# EAGLE schematic v1 (EAGLE 7.3.0)
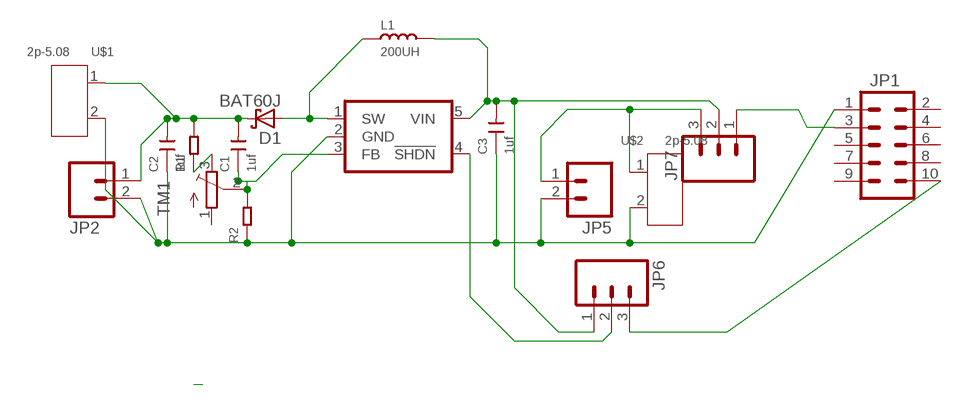
[diagram p0: schematic, sheet 1]

## Parts
C1  1uf  CERAMIC-1UF-25V-10%-X7R(0805)  [C0805]
C2  1uf  CERAMIC-1UF-25V-10%-X7R(0805)  [C0805]
C3  1uf  CERAMIC-1UF-25V-10%-X7R(0805)  [C0805]
D1  BAT60J  [SOD323_ST]
IC1  IC_FAN5331-SOT-23-5  [SOT-23-5]
JP1  M05X2PTH  [AVR_ICSP]
JP2  M02PTH  [1X02]
JP5  M02PTH  [1X02]
JP6  M03PTH  [1X03]
JP7  M03PTH  [1X03]
L1  200UH  SMD-INDUCTOR-200UH-20%(2P-5X5MM)  [SMD-2P-5.0X5.0X2.0MM]
R1  RES-0805  [R0805]
R2  RES-0805  [R0805]
TM1  TRIMPOTTC33X  [TC33X]
U$1  2p-5.08  DIP-BLUE-SCREW-TERMINAL(2P-5.08)  [H2-5.0-10.5X8.0MM]
U$2  2p-5.08  DIP-BLUE-SCREW-TERMINAL(2P-5.08)  [H2-5.0-10.5X8.0MM]

## Nets
GND: C2.1 C3.1 IC1.2(GND) JP1.1 JP2.2 JP5.2 R2.1 U$1.2 U$2.2
N$2: JP1.3 JP7.1
N$3: C3.2 IC1.5(VIN) JP6.1 JP7.2 L1.2
N$4: IC1.4(!SHDN) JP6.2
N$5: JP1.10 JP6.3
N$6: D1.A IC1.1(SW) L1.1
N$8: C1.2 C2.2 D1.C JP2.1 R1.2 U$1.1
N$9: C1.1 IC1.3(FB) R2.2 TM1.2(S)
N$10: JP5.1 JP7.3 U$2.1
N$11: R1.1 TM1.3(E)
Unconnected: JP1.2 JP1.4 JP1.5 JP1.6 JP1.7 JP1.8 JP1.9 TM1.1(A)

## Library data of the parts
C1-C3 = Seeed-OPL-Capacitor:CERAMIC-1UF-25V-10%-X7R(0805): 302010179; MPN: CC0805KKX7R8BB105
D1 = diode:BAT60J: Schottky barrier diode Source: www.st.com, BAT60J.pdf
IC1 = dp_devices:IC_FAN5331
JP1 = SparkFun-Connectors:M05X2: Header 5x2 Standard 10-pin dual row 0.1" header. Commonly used with AVR-ISP. Use with Spark Fun Electronics SKU: PRT-00778
JP2 JP5 = SparkFun-Connectors:M02: Standard 2-pin 0.1" header. Use with - straight break away headers ( PRT-00116) - right angle break away headers (PRT-00553) - swiss pins (PRT-00743) - machine pins (PRT-00117) - female headers (PRT-00115) Molex polarized connector foot print use with: PRT-08233 with associated crimp pins and housings. 2.54_SCREWTERM for use with PRT-10571. 3.5mm Screw Terminal footprints for PRT-08084 5mm Screw Terminal footprints for use with PRT-08432
JP6 JP7 = SparkFun-Connectors:M03: Header 3 Standard 3-pin 0.1" header. Use with straight break away headers (SKU : PRT-00116), right angle break away headers (PRT-00553), swiss pins (PRT-00743), machine pins (PRT-00117), and female headers (PRT-00115). Molex polarized connector foot print use with SKU : PRT-08232 with associated crimp pins and housings.
L1 = Seeed-OPL-Inductor:SMD-INDUCTOR-200UH-20%(2P-5X5MM): 303010140; MPN: SWPA5020S220MT
R1 R2 = Seeed-OPL-Resistor:RES
TM1 = adafruit:TRIMPOT: SMT trimmer potentiometer part number TC33X http://www.ladyada.net/library/eagle
U$1 U$2 = Seeed-OPL-Connector:DIP-BLUE-SCREW-TERMINAL(2P-5.08): 320110006; MPN: GS009S-2P-2